# Altium schematic sheet 10-Cooling Sensors.SchDoc
size A4
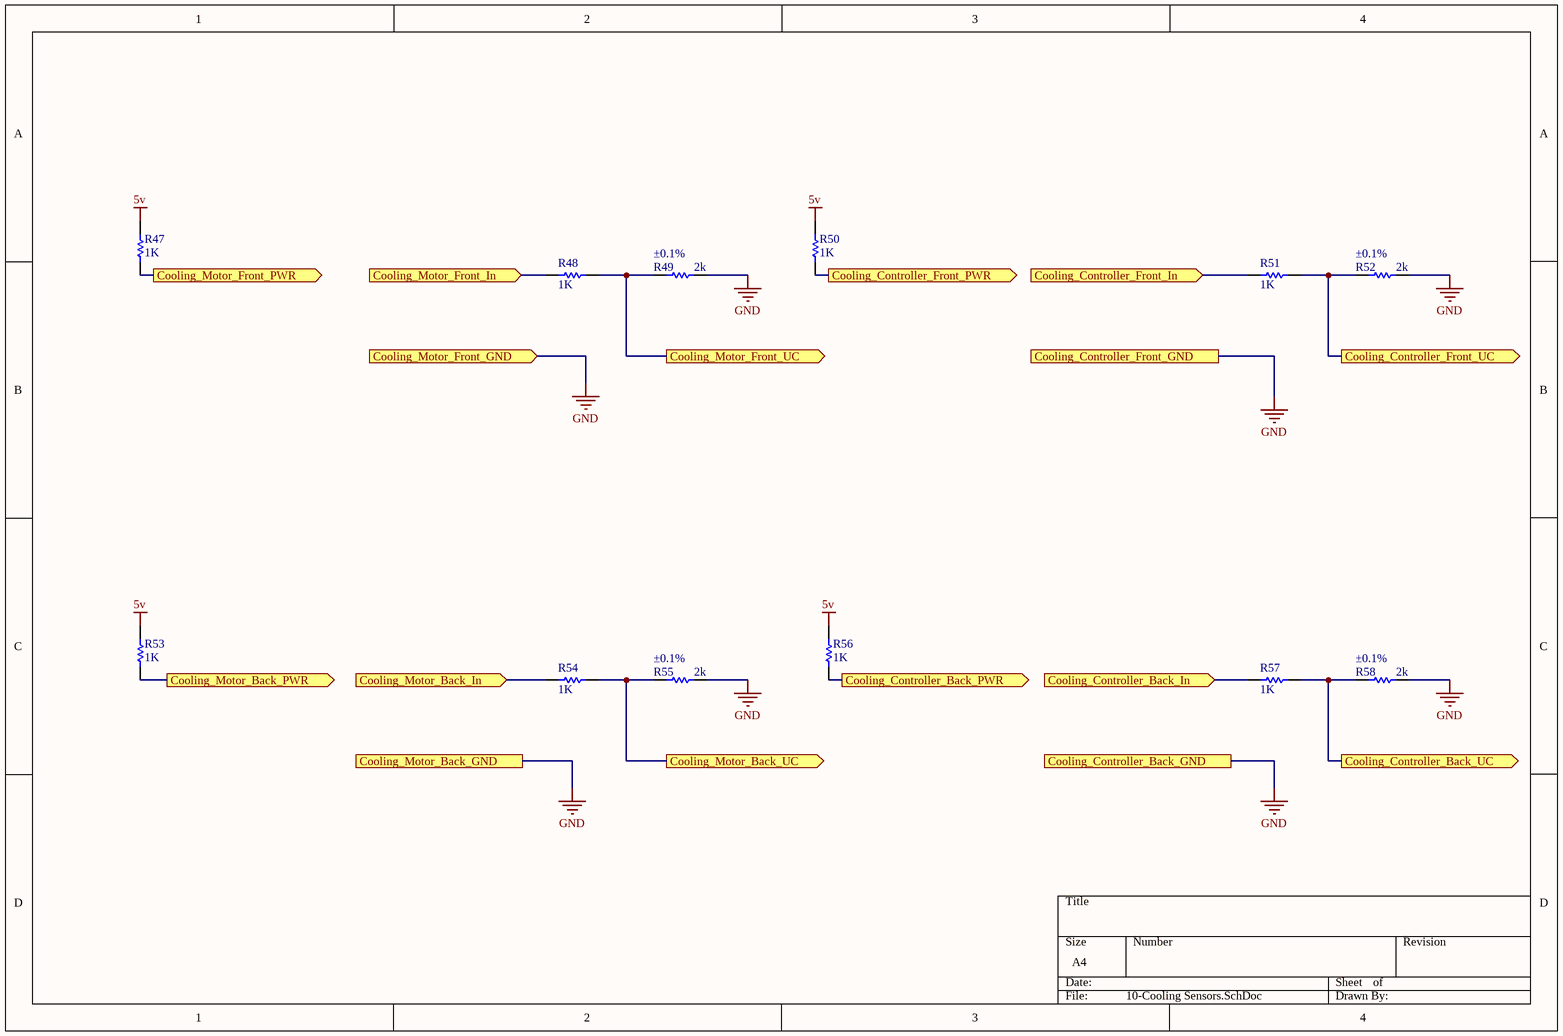
[diagram p0: 10-Cooling Sensors.SchDoc]

## Parts
R47  value 1K  [1608[0603]]  (hidden comment: Res1)
R48  value 1K  [1608[0603]]  (hidden comment: Res1)
R49  value 2k  Tolerance: ±0.1%  [1608[0603]]  (hidden comment: Res1)
R50  value 1K  [1608[0603]]  (hidden comment: Res1)
R51  value 1K  [1608[0603]]  (hidden comment: Res1)
R52  value 2k  Tolerance: ±0.1%  [1608[0603]]  (hidden comment: Res1)
R53  value 1K  [1608[0603]]  (hidden comment: Res1)
R54  value 1K  [1608[0603]]  (hidden comment: Res1)
R55  value 2k  Tolerance: ±0.1%  [1608[0603]]  (hidden comment: Res1)
R56  value 1K  [1608[0603]]  (hidden comment: Res1)
R57  value 1K  [1608[0603]]  (hidden comment: Res1)
R58  value 2k  Tolerance: ±0.1%  [1608[0603]]  (hidden comment: Res1)

## Ports
Cooling_Controller_Back_GND, Cooling_Controller_Back_In (in), Cooling_Controller_Back_PWR (out), Cooling_Controller_Back_UC (out), Cooling_Controller_Front_GND, Cooling_Controller_Front_In (in), Cooling_Controller_Front_PWR (out), Cooling_Controller_Front_UC (out), Cooling_Motor_Back_GND, Cooling_Motor_Back_In (in), Cooling_Motor_Back_PWR (out), Cooling_Motor_Back_UC (out), Cooling_Motor_Front_GND (in), Cooling_Motor_Front_In (in), Cooling_Motor_Front_PWR (out), Cooling_Motor_Front_UC (out)

## Nets
5v: R47.2 R50.2 R53.2 R56.2
GND: R49.2 R52.2 R55.2 R58.2 ; port Cooling_Controller_Front_GND, port Cooling_Controller_Back_GND, port Cooling_Motor_Front_GND, port Cooling_Motor_Back_GND
Cooling_Controller_Back_In: R57.2 ; port Cooling_Controller_Back_In
Cooling_Controller_Back_PWR: R56.1 ; port Cooling_Controller_Back_PWR
Cooling_Controller_Back_UC: R57.1 R58.1 ; port Cooling_Controller_Back_UC
Cooling_Controller_Front_In: R51.2 ; port Cooling_Controller_Front_In
Cooling_Controller_Front_PWR: R50.1 ; port Cooling_Controller_Front_PWR
Cooling_Controller_Front_UC: R51.1 R52.1 ; port Cooling_Controller_Front_UC
Cooling_Motor_Back_In: R54.2 ; port Cooling_Motor_Back_In
Cooling_Motor_Back_PWR: R53.1 ; port Cooling_Motor_Back_PWR
Cooling_Motor_Back_UC: R54.1 R55.1 ; port Cooling_Motor_Back_UC
Cooling_Motor_Front_In: R48.2 ; port Cooling_Motor_Front_In
Cooling_Motor_Front_PWR: R47.1 ; port Cooling_Motor_Front_PWR
Cooling_Motor_Front_UC: R48.1 R49.1 ; port Cooling_Motor_Front_UC

## Library data of the parts
R47 R48 R50 R51 R53 R54 R56 R57 = Res1: Resistor; Published: 8-Jun-2000; LatestRevisionDate: 17-Jul-2002; LatestRevisionNote: Re-released for DXP Platform.; PackageReference: AXIAL-0.3; Publisher: Altium Limited; PackageDescription: Axial Device, Thru-Hole; 2 Leads; 0.3 in Pin Spacing
R49 R52 R55 R58 = Res1: Resistor; Manufacturer: Yageo; Manufacturer Part Number: AT0603BRD072KL; Power (Watts): 0.1W, 1/10W; Temperature Coefficient: ±25ppm/°C; Supplier 1: Digi-Key; Supplier Part Number 1: YAG2112CT-ND; RoHS: RoHS Compliant; Category: Resistors; Stock 1: 1218; Pricing 1: 1=0.59, 10=0.431, 25=0.3188, 50=0.235, 100=0.1725, 250=0.14248, 500=0.11746, 1000=0.08498 (CAD); Packaging: Cut Tape (CT); Part Status: Active; Resistance (Ohms): 2k; Composition: Thin Film; Features: Anti-Sulfur, Automotive AEC-Q200, Moisture Resistant; Operating Temperature: -55°C ~ 155°C; Package / Case: 0603 (1608 Metric); Supplier Device Package: 0603; Size / Dimension: 0.063" L x 0.032" W (1.60mm x 0.80mm); Height - Seated (Max): 0.022" (0.55mm); Number of Terminations: 2; Failure Rate: -; ComponentLink1URL: http://www.yageo.com/documents/recent/PYu-AT_51_RoHS_L-3.pdf; ComponentLink1Description: http://www.yageo.com/documents/recent/PYu-AT_51_RoHS_L-3.pdf